# Altium schematic sheet Capacitive.SchDoc
size A
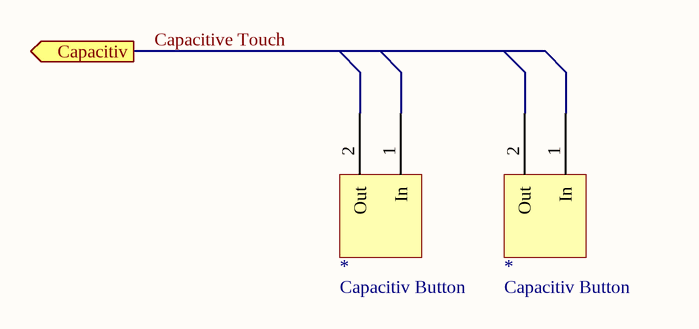
[diagram p0: Capacitive.SchDoc]

## Parts
(Parts that share a designator on the sheet are numbered #1, #2 ... from top to bottom, then left to right.)
*#1  Capacitiv Button
*#2  Capacitiv Button

## Ports
Capacitiv (out)

## Nets

Not connected (* = marked no-connect by the designer): *#1 1(In) 2(Out); *#2 1(In) 2(Out)

## Buses and harness runs
bus Capacitive Touch = port Capacitiv